# Altium schematic sheet badge3.SchDoc
size Letter
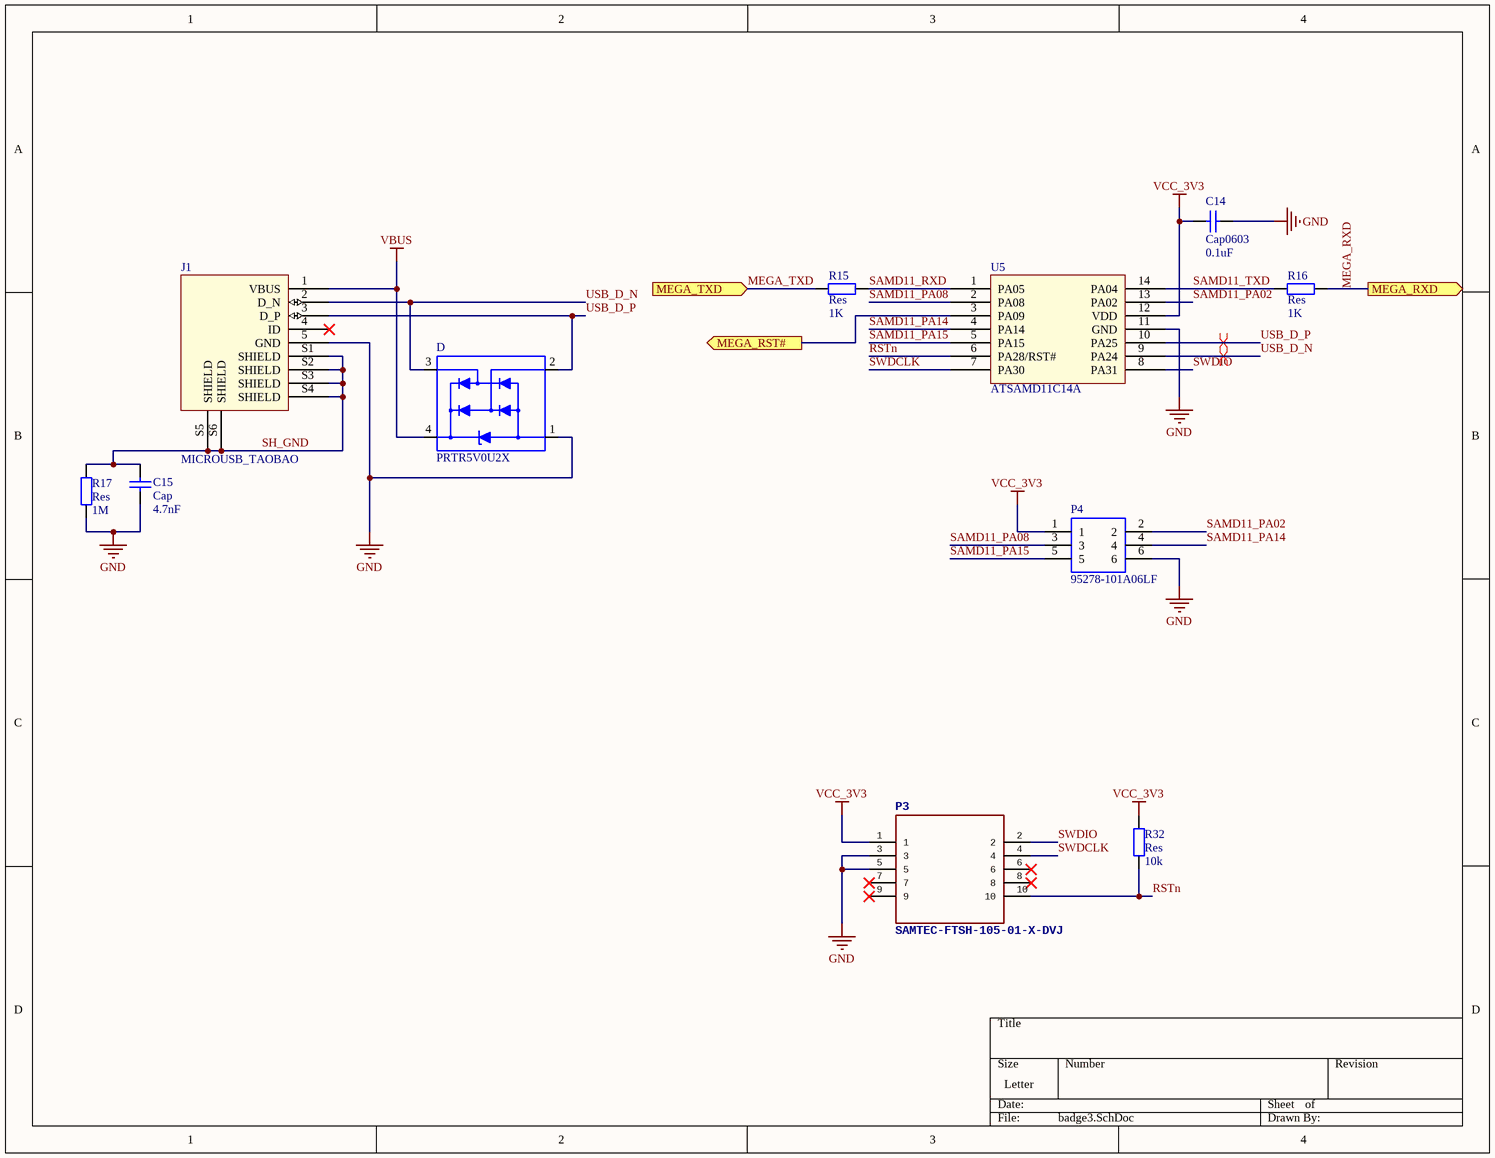
[diagram p0: badge3.SchDoc]

## Parts
C14  Cap0603  value 0.1uF  [C0603]
C15  Cap  value 4.7nF  [C0805]
D  PRTR5V0U2X  [SOT190P230X110-4N]
J1  MICROUSB_TAOBAO  [MICROUSB_TAOBAO]
P3  SAMTEC-FTSH-105-01-X-DVJ  [SAMTEC-FTSH-105-01-X-DV]
P4  95278-101A06LF  [AMPHENOL_95278-101A06LF]
R15  Res  value 1K  [R0603]
R16  Res  value 1K  [R0603]
R17  Res  value 1M  [R0603]
R32  Res  value 10k  [R0603]
U5  ATSAMD11C14A  [SOIC127P600X175-14N]

## Ports
MEGA_RST# (out), MEGA_RXD (out), MEGA_TXD (in)

## Nets
GND: C14.2 C15.1 D.1(GND) J1.5(GND) P3.3 P3.5 P4.6 R17.1 U5.11(GND)
VBUS: D.4(VCC) J1.1(VBUS)
VCC_3V3: C14.1 P3.1 P4.1 R32.2 U5.12(VDD)
MEGA_RST#: U5.3(PA09) ; port MEGA_RST#
MEGA_RXD: R16.2 ; port MEGA_RXD
MEGA_TXD: R15.1 ; port MEGA_TXD
RSTn: P3.10 R32.1 U5.6(PA28/RST#)
SAMD11_PA02: P4.2 U5.13(PA02)
SAMD11_PA08: P4.3 U5.2(PA08)
SAMD11_PA14: P4.4 U5.4(PA14)
SAMD11_PA15: P4.5 U5.5(PA15)
SAMD11_RXD: R15.2 U5.1(PA05)
SAMD11_TXD: R16.1 U5.14(PA04)
SH_GND: C15.2 J1.S1(SHIELD) J1.S2(SHIELD) J1.S3(SHIELD) J1.S4(SHIELD) J1.S5(SHIELD) J1.S6(SHIELD) R17.2
SWDCLK: P3.4 U5.7(PA30)
SWDIO: P3.2 U5.8(PA31)
USB_D_N: D.3(I/O_2) J1.2(D_N) U5.9(PA24)
USB_D_P: D.2(I/O_1) J1.3(D_P) U5.10(PA25)

Not connected (* = marked no-connect by the designer): J1 4(ID)*; P3 6* 7* 8* 9*

## Layout directives
differential pair: USB_D_N, USB_D_P

## Library data of the parts
C14 = Cap0603: Capacitor; MF: KEMET; MP: C0603C104Z3VACTU; Published: 8-Jun-2000; LatestRevisionDate: 17-Jul-2002; LatestRevisionNote: Re-released for DXP Platform.; PackageReference: 0603; Publisher: Altium Limited; PackageDescription: SMD Capacitor
C15 = Cap: Capacitor; MP: C0805C472KDRACTU; MF: KEMET; Published: 8-Jun-2000; LatestRevisionDate: 17-Jul-2002; LatestRevisionNote: Re-released for DXP Platform.; PackageReference: 0805; Publisher: Altium Limited; PackageDescription: SMD Capacitor
D = PRTR5V0U2X: Clamp Ipp Tvs Diode Surface Mount SOT-143B; MF: NXP Semiconductors; Package: SOT-143 NXP Semiconductors; MP: PRTR5V0U2X; Availability: Unavailable; Price: None; Value: *; SnapEDA_Link: https://www.snapeda.com/parts/PRTR5V0U2X/NXP%20Semiconductors/view-part/4254511/?ref=snap
J1 = MICROUSB_TAOBAO: MF: DNP; MP: DNP
P3 = SAMTEC-FTSH-105-01-X-DVJ: MF: Samtec; MP: FTS-105-01-L-DV
P4 = 95278-101A06LF: Connector Header Surface Mount 6 position 0.100 _2.54mm_; MF: Amphenol ICC; Package: None; Value: *; Price: None; MP: 95278-101A06LF; Availability: Unavailable; SnapEDA_Link: https://www.snapeda.com/parts/95278-101A06LF/Amphenol%20FCI/view-part/2763224/?ref=snap
R15 R16 = Res: Resistor; MF: Yageo; MP: RC0603JR-071KL; Published: 8-Jun-2000; LatestRevisionDate: 17-Jul-2002; LatestRevisionNote: Re-released for DXP Platform.; Publisher: Altium Limited; PackageDescription: SMD Resistor
  R15: PackageReference: 0603
  R16: PackageReference: AXIAL-0.4
R17 = Res: Resistor; MF: Yageo; MP: RC0603FR-071ML; Published: 8-Jun-2000; LatestRevisionDate: 17-Jul-2002; LatestRevisionNote: Re-released for DXP Platform.; PackageReference: AXIAL-0.4; Publisher: Altium Limited; PackageDescription: SMD Resistor
R32 = Res: Resistor; MF: Yageo; MP: RC0603JR-0710KL; Published: 8-Jun-2000; LatestRevisionDate: 17-Jul-2002; LatestRevisionNote: Re-released for DXP Platform.; PackageReference: AXIAL-0.4; Publisher: Altium Limited; PackageDescription: SMD Resistor
U5 = ATSAMD11C14A: MF: Atmel; MP: ATSAMD11C14A-SSNTDKR-ND